# Altium schematic sheet Sensor_Board.SchDoc: Mach Probe Data Logger
size A4; Date: 16.03.2025; Author: Bexultan Tokkozha; CompanyName: WARR e.V.; DrawnBy: Bexultan Tokkozha; Engineer: Bexultan Tokkozha; Organization: WARR e.V.; Address1: Boltzmannstr. 15; Address2: 85748 Garching; Address3: Germany; Revision: Rev.1; SheetNumber: 1; SheetTotal: 1
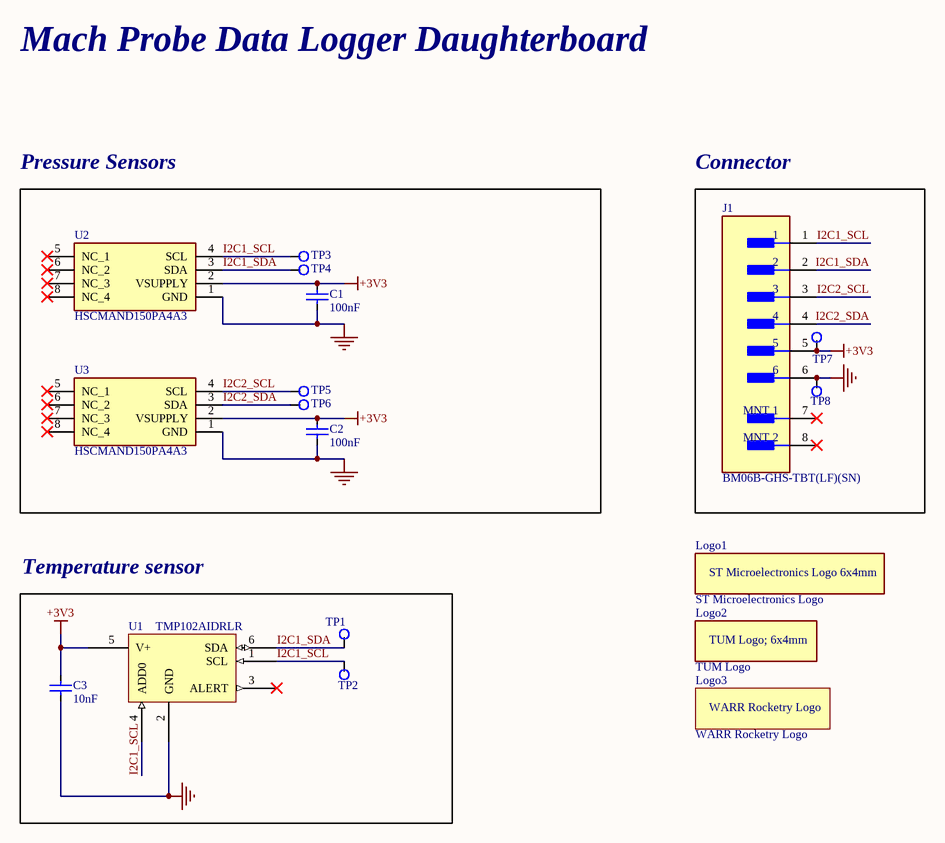
[diagram p0: Sensor_Board.SchDoc]

## Parts
C1  value 100nF  [CAP_0603]  (hidden comment: C_0603_100n_5%_50V)
C2  value 100nF  [CAP_0603]  (hidden comment: C_0603_100n_5%_50V)
C3  value 10nF  [CAP_0603]  (hidden comment: C_0603_10n_5%_50V)
J1  BM06B-GHS-TBT(LF)(SN)  [FP-BM06B-GHS-TBT_LF_SN-MFG]
Logo1  ST Microelectronics Logo  [New footprint 1]
Logo2  TUM Logo  [New footprint 1]
Logo3  WARR Rocketry Logo  [WARR Rocketry Logo-Footprint-1]
TP1  Testpoint  [Testpoint-Footprint-1]  (value not drawn)  (no BOM)
TP2  Testpoint  [Testpoint-Footprint-1]  (value not drawn)  (no BOM)
TP3  Testpoint  [Testpoint-Footprint-1]  (value not drawn)  (no BOM)
TP4  Testpoint  [Testpoint-Footprint-1]  (value not drawn)  (no BOM)
TP5  Testpoint  [Testpoint-Footprint-1]  (value not drawn)  (no BOM)
TP6  Testpoint  [Testpoint-Footprint-1]  (value not drawn)  (no BOM)
TP7  Testpoint  [Testpoint-Footprint-1]  (value not drawn)  (no BOM)
TP8  Testpoint  [Testpoint-Footprint-1]  (value not drawn)  (no BOM)
U1  TMP102AIDRLR  [SOTFL127P600-8N]
U2  HSCMAND150PA4A3  [HSCMAND150PA4A3]
U3  HSCMAND150PA4A3  [HSCMAND150PA4A3]

## Blocks framed on the sheet
Pressure Sensors: C1 C2 TP3-TP6 U2 U3
Connector: J1 TP7 TP8
Temperature sensor: C3 TP1 TP2 U1

## Nets
+3V3: C1.1 C2.1 C3.1 J1.5 TP7.1 U1.5(V+) U2.2(VSUPPLY) U3.2(VSUPPLY)
GND: C1.2 C2.2 C3.2 J1.6 TP8.1 U1.2(GND) U2.1(GND) U3.1(GND)
I2C1_SCL: J1.1 TP2.1 TP3.1 U1.1(SCL) U1.4(ADD0) U2.4(SCL)
I2C1_SDA: J1.2 TP1.1 TP4.1 U1.6(SDA) U2.3(SDA)
I2C2_SCL: J1.3 TP5.1 U3.4(SCL)
I2C2_SDA: J1.4 TP6.1 U3.3(SDA)

Not connected (* = marked no-connect by the designer): J1 7(MNT_1)* 8(MNT_2)*; U1 3(ALERT)*; U2 5(NC_1)* 6(NC_2)* 7(NC_3)* 8(NC_4)*; U3 5(NC_1)* 6(NC_2)* 7(NC_3)* 8(NC_4)*

## Notes on the sheet
- Mach Probe Data Logger Daughterboard
- Designers:
- Reviewers:
- Date:
- Time:
- Revision:
- Review Date:
- Sheet
- of
- (in symbol CMP-00030-00022-1) TUM Logo; 6x4mm

## Library data of the parts
C1 C2 = CMP-001-00115-4: Ceramic Capacitor, Multilayer, Ceramic, 50V, 5% +Tol, 5% -Tol, X7R, 15% TC, 0.1uF, Surface Mount, 0603; Voltage Rating: 50V; Capacitor Type: Ceramic; Max Operating Temperature: 125°C; Pins: 2; Case/Package: 0603; Min Operating Temperature: -55°C; Mounting Technology: Surface Mount; RoHS Compliant: Yes
C3 = CMP-001-00107-9: Ceramic Capacitor, Multilayer, Ceramic, 50V, 5% +Tol, 5% -Tol, X7R, 15% TC, 0.01uF, Surface Mount, 0603; Capacitor Type: Ceramic; Mounting Technology: Surface Mount; Tolerance: 5%; Case/Package: 0603; Pins: 2; Voltage Rating: 50V; RoHS Compliant: Yes; Min Operating Temperature: -55°C; Max Operating Temperature: 125°C
J1 = CMP-17439-000166-1: CONN HEADER SMD 6POS 1.25MM; Number of Contacts: 6; Current Rating: 1A; Voltage Rating: 50V; Housing Material: Nylon; Lead Free: Lead Free; Pitch: 1.25mm; Packaging: Cut Tape; Number of Rows: 1; Series: GH; Contact Material: Bronze; Orientation: Straight; Termination: Solder; Mount: Surface Mount; Housing Color: Natural; Number of Positions: 6
Logo1 = CMP-00030-00023-1: ST Microelectronics Logo 6x4mm
Logo2 = CMP-00030-00022-1: 6 x 4 mm TUM Logo
Logo3 = CMP-00030-00024-1
TP1-TP8 = CMP-00030-00002-7: Schematic for Testpoint
U1 = CMP-00053-2: Digital Temperature Sensor, I2C,12 Bit(s), ±2C, SOT563; Min Operating Temperature: -40°C; Max Operating Temperature: 125°C; LCSC Part Number: C99269; Mouser Part Number: 595-TMP102AIDRLR
U2 U3 = HSCMAND150PA4A3: Undefined or Miscellaneous; Manufacturer_Name: Honeywell; Datasheet Link: https://prod-edam.honeywell.com/content/dam/honeywell-edam/sps/siot/en-us/products/sensors/pressure-sensors/board-mount-pressure-sensors/trustability-hsc-series/documents/sps-siot-trustability-hsc-series-high-accuracy-board-mount-pressure-sensors-50099148; Height: 14.72mm; Manufacturer_Part_Number: HSCMAND150PA4A3; Mouser Part Number: 785-HSCMAND150PA4A3; Mouser Price/Stock: https://www.mouser.co.uk/ProductDetail/Honeywell/HSCMAND150PA4A3?qs=o9%252Bd3bvuvbJEKEw%2FoGffSA%3D%3D; Arrow Part Number: HSCMAND150PA4A3; Arrow Price/Stock: https://www.arrow.com/en/products/hscmand150pa4a3/honeywell?region=nac